# EAGLE schematic humanoid-3 (EAGLE 7.2.0)

## Sheet 1 of 8
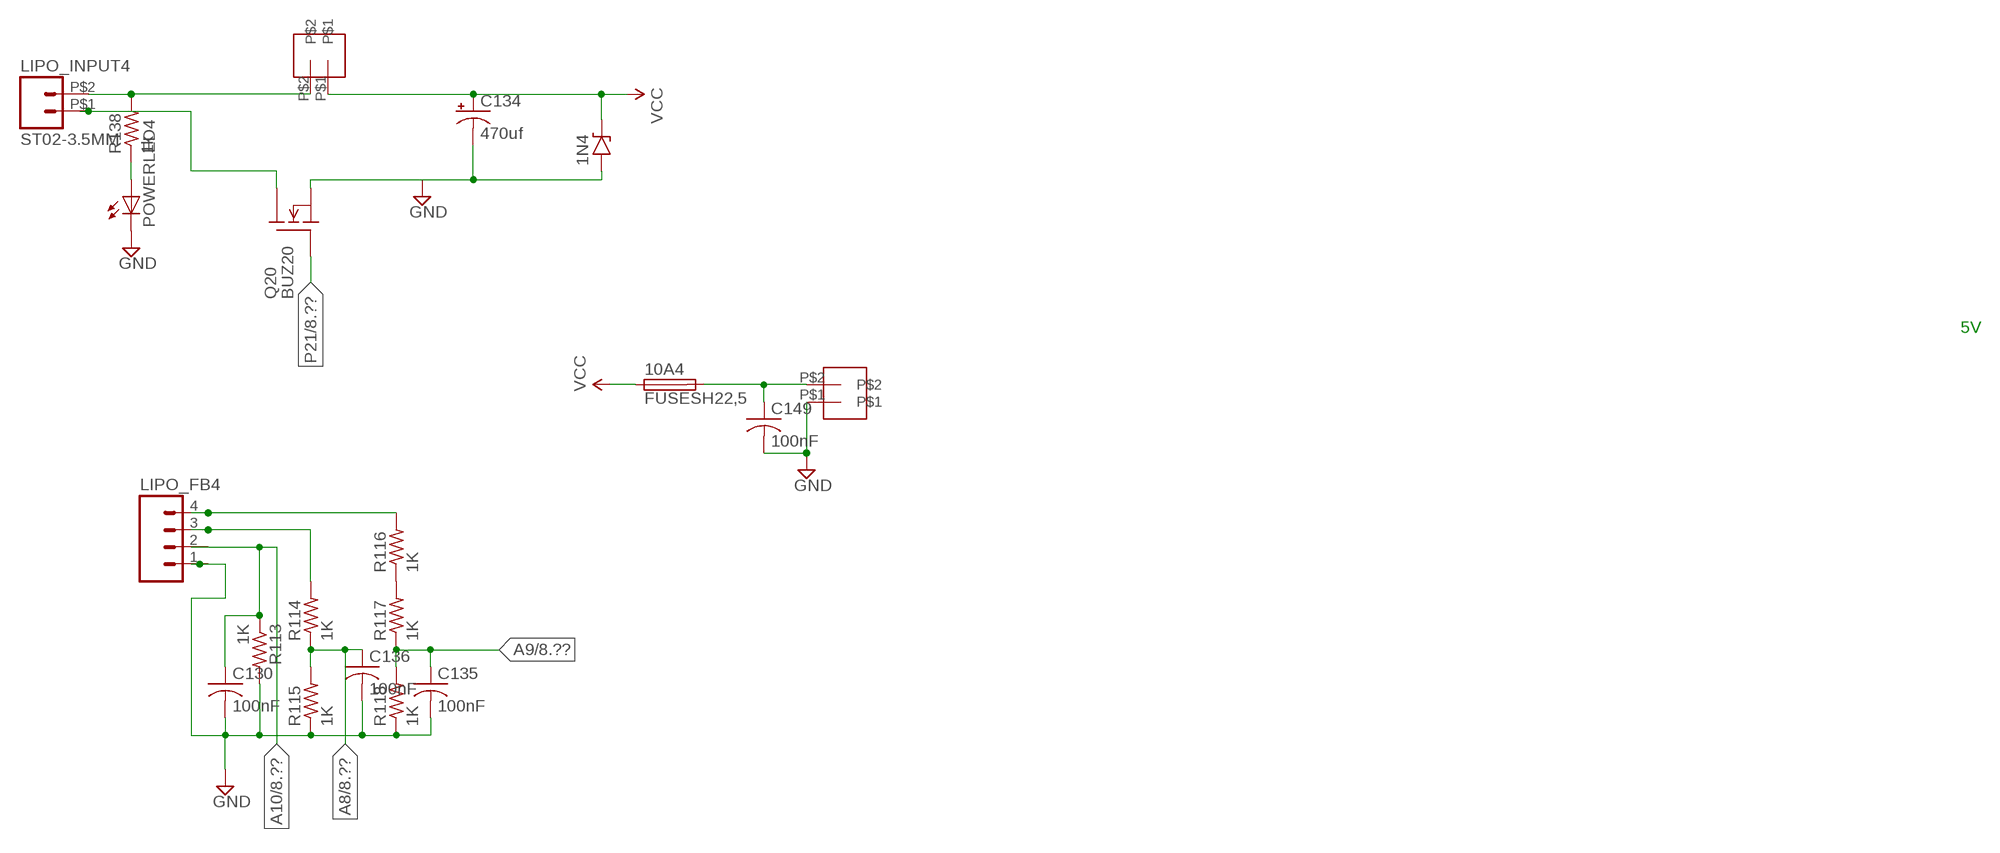
[diagram p0: schematic, sheet 1]

### Parts
1N4  1N47XX3  [DO41-3]
10A4  FUSESH22,5  [SH22,5]
C130  100nF  C-USC1206  [C1206]
C134  470uf  CPOL-USD  [PANASONIC_D]
C135  100nF  C-USC1206  [C1206]
C136  100nF  C-USC1206  [C1206]
C149  100nF  C-USC1206  [C1206]
FITPC4  2PINRIGHT  [2PINRIGHT]
LIPO_FB4  M04PTH  [1X04]
LIPO_INPUT4  ST02-3.5MM  [ED350V-02P]
POWERLED4  LEDCHIPLED_1206  [CHIPLED_1206]
Q20  BUZ20  [TO220]
R113  1K  R-US_M0805  [M0805]
R114  1K  R-US_M0805  [M0805]
R115  1K  R-US_M0805  [M0805]
R116  1K  R-US_M0805  [M0805]
R117  1K  R-US_M0805  [M0805]
R118  1K  R-US_M0805  [M0805]
R138  1k  R-US_M0805  [M0805]
U$89  2PINRIGHT  [2PINRIGHT]

### Nets
A8: C136.1 R114.1 R115.2 ; also sheet 8
A9: C135.1 R117.1 R118.2 ; also sheet 8
A10: C130.1 LIPO_FB4.2 R113.1 ; also sheet 8
GND: 1N4.A C130.2 C134.- C135.2 C136.2 C149.2 FITPC4.P$1 LIPO_FB4.1 POWERLED4.C Q20.3(S) R113.2 R115.1 R118.1 ; also sheet 2,3,4,5,6,7,8
LIPO_FB4: LIPO_FB4.4 R116.2
N$337: R116.1 R117.2
N$338: LIPO_FB4.3 R114.2
N$378: 10A4.2 C149.1 FITPC4.P$2
N$381: POWERLED4.A R138.1
N$383: LIPO_INPUT4.P$1 Q20.2(D)
N$385: LIPO_INPUT4.P$2 R138.2 U$89.P$2
P21: Q20.1(G) ; also sheet 8
VCC: 1N4.C 10A4.1 C134.+ U$89.P$1 ; also sheet 2,3,4

### Notes on the sheet
- 5V

## Sheet 2 of 8
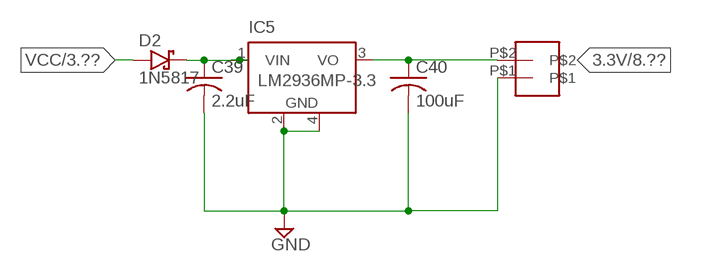
[diagram p1: schematic, sheet 2]

### Parts
3.3V1  2PINRIGHT  [2PINRIGHT]
C39  2.2uF  C-USC1206  [C1206]
C40  100uF  C-USC1206  [C1206]
D2  1N5817  [DO41-3]
IC5  LM2936MP-3.3  [SOT223]

### Nets
3.3V: 3.3V1.P$2 C40.1 IC5.3(VO) ; also sheet 8
GND: 3.3V1.P$1 C39.2 C40.2 IC5.2(GND) IC5.4(GND) ; also sheet 1,3,4,5,6,7,8
N$51: C39.1 D2.C IC5.1(VIN)
VCC: D2.A ; also sheet 1,3,4

## Sheet 3 of 8
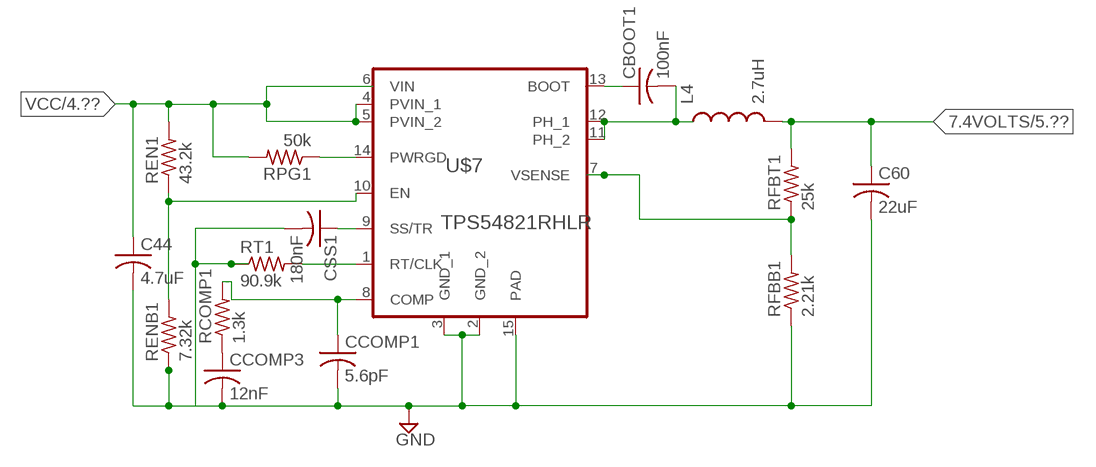
[diagram p2: schematic, sheet 3]

### Parts
C44  4.7uF  C-USC1206  [C1206]
C60  22uF  C-USC1206  [C1206]
CBOOT1  100nF  C-USC1206  [C1206]
CCOMP1  5.6pF  C-USC1206  [C1206]
CCOMP3  12nF  C-USC1206  [C1206]
CSS1  180nF  C-USC1206  [C1206]
L4  2.7uH  INDUCTOR-B82462G  [B82462G]
RCOMP1  1.3k  R-US_M0805  [M0805]
REN1  43.2k  R-US_M0805  [M0805]
RENB1  7.32k  R-US_M0805  [M0805]
RFBB1  2.21k  R-US_M0805  [M0805]
RFBT1  25k  R-US_M0805  [M0805]
RPG1  50k  R-US_M0805  [M0805]
RT1  90.9k  R-US_M0805  [M0805]
U$7  TPS54821RHLR  [S-PVQFN-N14]

### Nets
7.4VOLTS: C60.1 L4.P$2 RFBT1.2 ; also sheet 5
GND: C44.2 C60.2 CCOMP1.2 CCOMP3.2 CSS1.2 RENB1.1 RFBB1.1 RT1.1 U$7.2(GND_2) U$7.3(GND_1) U$7.15(PAD) ; also sheet 1,2,4,5,6,7,8
N$53: CBOOT1.2 L4.P$1 U$7.11(PH_2) U$7.12(PH_1)
N$54: RT1.2 U$7.1(RT/CLK)
N$55: CSS1.1 U$7.9(SS/TR)
N$56: RPG1.1 U$7.14(PWRGD)
N$57: CCOMP3.1 RCOMP1.1
N$58: CCOMP1.1 RCOMP1.2 U$7.8(COMP)
N$59: CBOOT1.1 U$7.13(BOOT)
N$60: RFBB1.2 RFBT1.1 U$7.7(VSENSE)
N$68: REN1.1 RENB1.2 U$7.10(EN)
VCC: C44.1 REN1.2 RPG1.2 U$7.4(PVIN_1) U$7.5(PVIN_2) U$7.6(VIN) ; also sheet 1,2,4

## Sheet 4 of 8
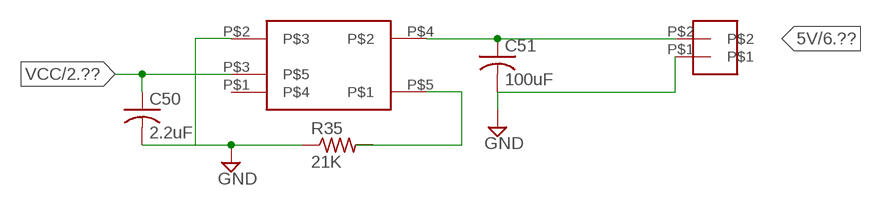
[diagram p3: schematic, sheet 4]

### Parts
5V1  2PINRIGHT  [2PINRIGHT]
C50  2.2uF  C-USC1206  [C1206]
C51  100uF  C-USC1206  [C1206]
R35  21K  R-US_M0805  [M0805]
U$6  PTN7800WTHROUGHHOLE  [PTN7800W]

### Nets
5V: 5V1.P$2 C51.1 U$6.P$4 ; also sheet 6,7,8
GND: 5V1.P$1 C50.2 C51.2 R35.1 U$6.P$2 ; also sheet 1,2,3,5,6,7,8
N$76: R35.2 U$6.P$5
VCC: C50.1 U$6.P$3 ; also sheet 1,2,3
Unconnected: U$6.P$1

## Sheet 5 of 8
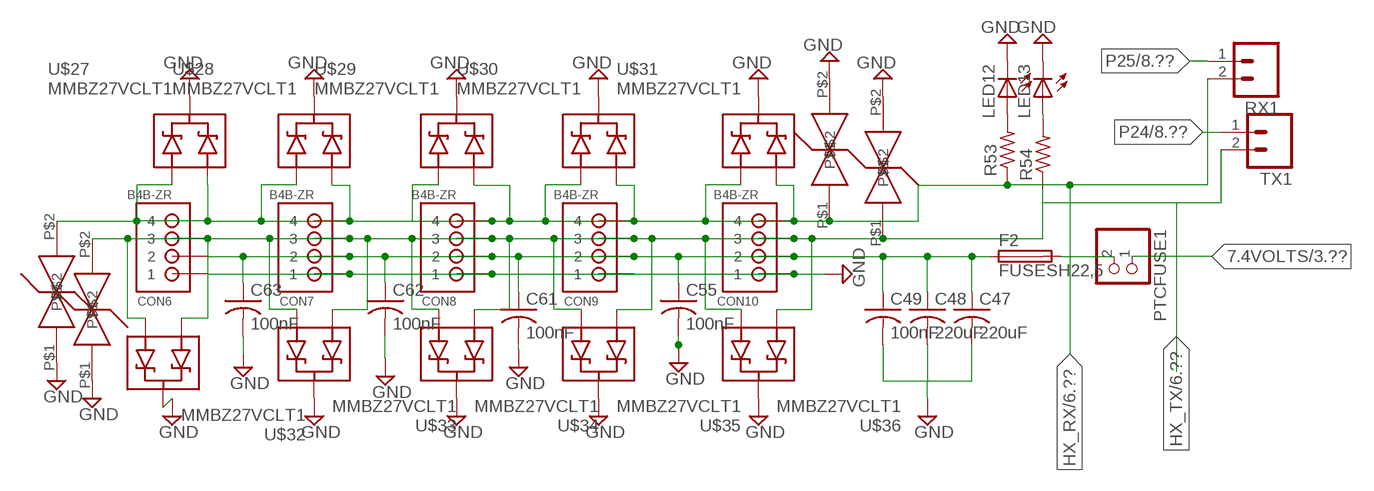
[diagram p4: schematic, sheet 5]

### Parts
C47  220uF  C-USC1206  [C1206]
C48  220uF  C-USC1206  [C1206]
C49  100nF  C-USC1206  [C1206]
C55  100nF  C-USC1206  [C1206]
C61  100nF  C-USC1206  [C1206]
C62  100nF  C-USC1206  [C1206]
C63  100nF  C-USC1206  [C1206]
CON6  B4B-ZR  [B4B-ZR]
CON7  B4B-ZR  [B4B-ZR]
CON8  B4B-ZR  [B4B-ZR]
CON9  B4B-ZR  [B4B-ZR]
CON10  B4B-ZR  [B4B-ZR]
F2  FUSESH22,5  [SH22,5]
LED12  LEDCHIPLED_1206  [CHIPLED_1206]
LED13  LEDCHIPLED_1206  [CHIPLED_1206]
PTCFUSE1  PINHD-1X2  [1X02]
R53  R-US_M0805  [M0805]
R54  R-US_M0805  [M0805]
RX1  M02PTH  [1X02]
TX1  M02PTH  [1X02]
U$11  V18ZA2P  [V18ZA2P]
U$25  V18ZA2P  [V18ZA2P]
U$26  V18ZA2P  [V18ZA2P]
U$27  MMBZ27VCLT1  [SOT23-3]
U$28  MMBZ27VCLT1  [SOT23-3]
U$29  MMBZ27VCLT1  [SOT23-3]
U$30  MMBZ27VCLT1  [SOT23-3]
U$31  MMBZ27VCLT1  [SOT23-3]
U$32  MMBZ27VCLT1  [SOT23-3]
U$33  MMBZ27VCLT1  [SOT23-3]
U$34  MMBZ27VCLT1  [SOT23-3]
U$35  MMBZ27VCLT1  [SOT23-3]
U$36  MMBZ27VCLT1  [SOT23-3]
V18ZA2P1  V18ZA2P  [V18ZA2P]

### Nets
7.4VOLTS: PTCFUSE1.1 ; also sheet 3
GND: C47.2 C48.2 C49.2 C55.2 C61.2 C62.2 CON6.1 CON7.1 CON8.1 CON9.1 CON10.1 LED12.C LED13.C U$11.P$1 U$25.P$2 U$26.P$2 U$27.3(C) U$28.3(C) U$29.3(C) U$30.3(C) U$31.3(C) U$32.3(C) U$33.3(C) U$34.3(C) U$35.3(C) U$36.3(C) V18ZA2P1.P$1 ; also sheet 1,2,3,4,6,7,8
HX_RX: CON6.4 CON7.4 CON8.4 CON9.4 CON10.4 R53.1 RX1.2 U$25.P$1 U$27.1(A1) U$27.2(A2) U$28.1(A1) U$28.2(A2) U$29.1(A1) U$29.2(A2) U$30.1(A1) U$30.2(A2) U$31.1(A1) U$31.2(A2) V18ZA2P1.P$2 ; also sheet 6
HX_TX: CON6.3 CON7.3 CON8.3 CON9.3 CON10.3 R54.1 TX1.2 U$11.P$2 U$26.P$1 U$32.1(A1) U$32.2(A2) U$33.1(A1) U$33.2(A2) U$34.1(A1) U$34.2(A2) U$35.1(A1) U$35.2(A2) U$36.1(A1) U$36.2(A2) ; also sheet 6
N$1: C63.2
N$70: F2.2 PTCFUSE1.2
N$73: LED12.A R53.2
N$74: LED13.A R54.2
N$80: C47.1 C48.1 C49.1 C55.1 C61.1 C62.1 C63.1 CON6.2 CON7.2 CON8.2 CON9.2 CON10.2 F2.1
P24: TX1.1 ; also sheet 8
P25: RX1.1 ; also sheet 8

## Sheet 6 of 8
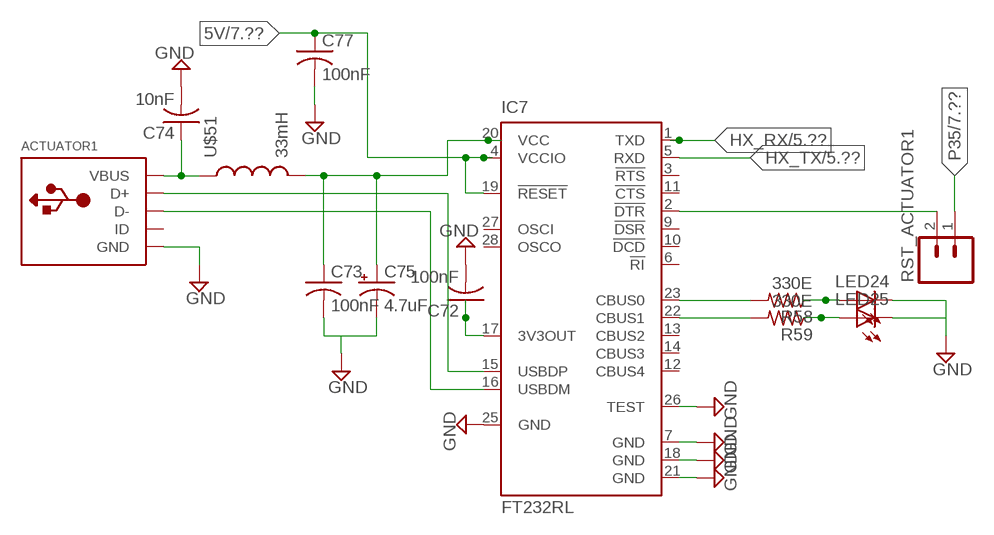
[diagram p5: schematic, sheet 6]

### Parts
ACTUATOR1  USBMINIB  [USB-MINIB]
C72  100nF  C-USC1206  [C1206]
C73  100nF  C-USC1206  [C1206]
C74  10nF  C-USC1206  [C1206]
C75  4.7uF  CPOL-USD  [PANASONIC_D]
C77  100nF  C-USC1206  [C1206]
IC7  FT232RL  [SSOP28]
LED24  LEDCHIPLED_1206  [CHIPLED_1206]
LED25  LEDCHIPLED_1206  [CHIPLED_1206]
R58  330E  R-US_M0805  [M0805]
R59  330E  R-US_M0805  [M0805]
RST_ACTUATOR1  M02PTH  [1X02]
U$51  33mH  INDUCTOR-B82462G  [B82462G]

### Nets
5V: C77.1 IC7.4(VCCIO) IC7.19(!RESET) ; also sheet 4,7,8
GND: ACTUATOR1.GND C72.2 C73.2 C74.2 C75.- C77.2 IC7.7(GND) IC7.18(GND) IC7.21(GND) IC7.25(GND) IC7.26(TEST) LED24.C LED25.C ; also sheet 1,2,3,4,5,7,8
HX_RX: IC7.1(TXD) ; also sheet 5
HX_TX: IC7.5(RXD) ; also sheet 5
N$92: ACTUATOR1.VBUS C74.1 U$51.P$1
N$93: C73.1 C75.+ IC7.20(VCC) U$51.P$2
N$94: ACTUATOR1.D+ IC7.15(USBDP)
N$95: ACTUATOR1.D- IC7.16(USBDM)
N$106: IC7.23(CBUS0) R58.2
N$108: IC7.22(CBUS1) R59.2
N$109: LED24.A R58.1
N$114: LED25.A R59.1
N$115: C72.1 IC7.17(3V3OUT)
N$116: IC7.2(!DTR) RST_ACTUATOR1.2
P35: RST_ACTUATOR1.1 ; also sheet 7,8
Unconnected: ACTUATOR1.ID IC7.3(!RTS) IC7.6(!RI) IC7.9(!DSR) IC7.10(!DCD) IC7.11(!CTS) IC7.12(CBUS4) IC7.13(CBUS2) IC7.14(CBUS3) IC7.27(OSCI) IC7.28(OSCO)

## Sheet 7 of 8
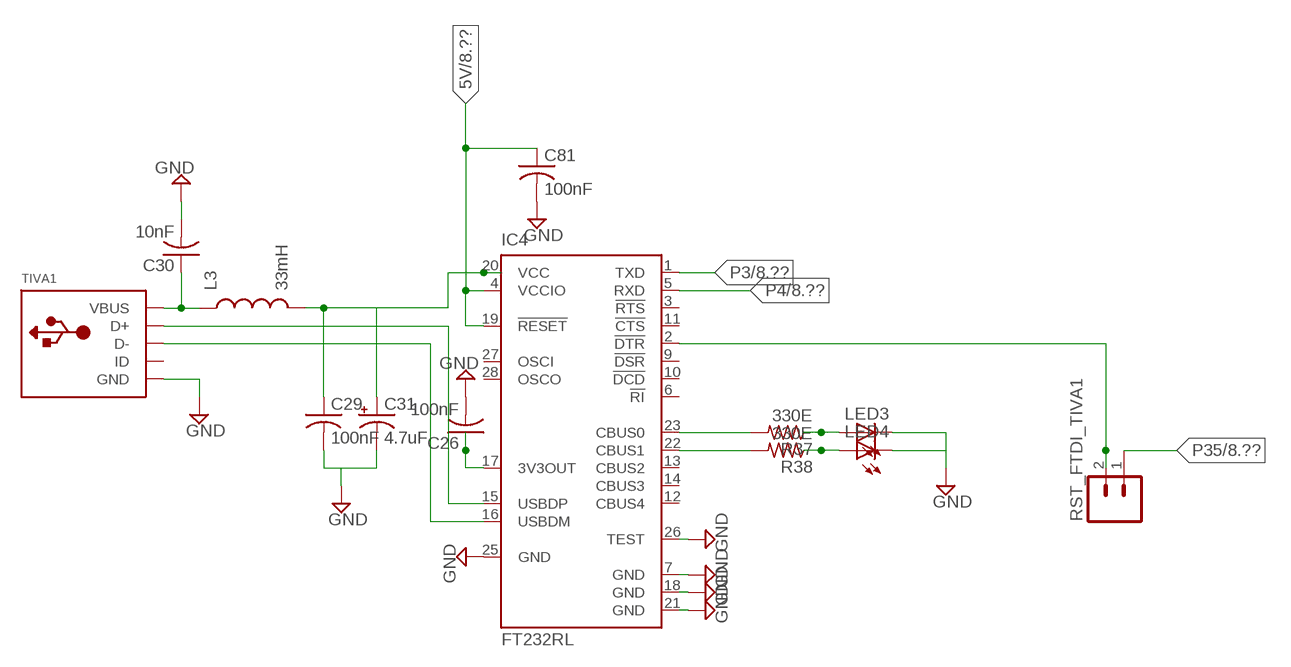
[diagram p6: schematic, sheet 7]

### Parts
C26  100nF  C-USC1206  [C1206]
C29  100nF  C-USC1206  [C1206]
C30  10nF  C-USC1206  [C1206]
C31  4.7uF  CPOL-USD  [PANASONIC_D]
C81  100nF  C-USC1206  [C1206]
IC4  FT232RL  [SSOP28]
L3  33mH  INDUCTOR-B82462G  [B82462G]
LED3  LEDCHIPLED_1206  [CHIPLED_1206]
LED4  LEDCHIPLED_1206  [CHIPLED_1206]
R37  330E  R-US_M0805  [M0805]
R38  330E  R-US_M0805  [M0805]
RST_FTDI_TIVA1  M02PTH  [1X02]
TIVA1  USBMINIB  [USB-MINIB]

### Nets
5V: C81.1 IC4.4(VCCIO) IC4.19(!RESET) ; also sheet 4,6,8
GND: C26.2 C29.2 C30.2 C31.- C81.2 IC4.7(GND) IC4.18(GND) IC4.21(GND) IC4.25(GND) IC4.26(TEST) LED3.C LED4.C TIVA1.GND ; also sheet 1,2,3,4,5,6,8
N$7: C30.1 L3.P$1 TIVA1.VBUS
N$10: C29.1 C31.+ IC4.20(VCC) L3.P$2
N$11: IC4.15(USBDP) TIVA1.D+
N$12: IC4.16(USBDM) TIVA1.D-
N$13: IC4.23(CBUS0) R37.2
N$19: IC4.22(CBUS1) R38.2
N$22: LED3.A R37.1
N$33: LED4.A R38.1
N$34: C26.1 IC4.17(3V3OUT)
N$35: IC4.2(!DTR) RST_FTDI_TIVA1.2
P3: IC4.1(TXD) ; also sheet 8
P4: IC4.5(RXD) ; also sheet 8
P35: RST_FTDI_TIVA1.1 ; also sheet 6,8
Unconnected: IC4.3(!RTS) IC4.6(!RI) IC4.9(!DSR) IC4.10(!DCD) IC4.11(!CTS) IC4.12(CBUS4) IC4.13(CBUS2) IC4.14(CBUS3) IC4.27(OSCI) IC4.28(OSCO) TIVA1.ID

## Sheet 8 of 8
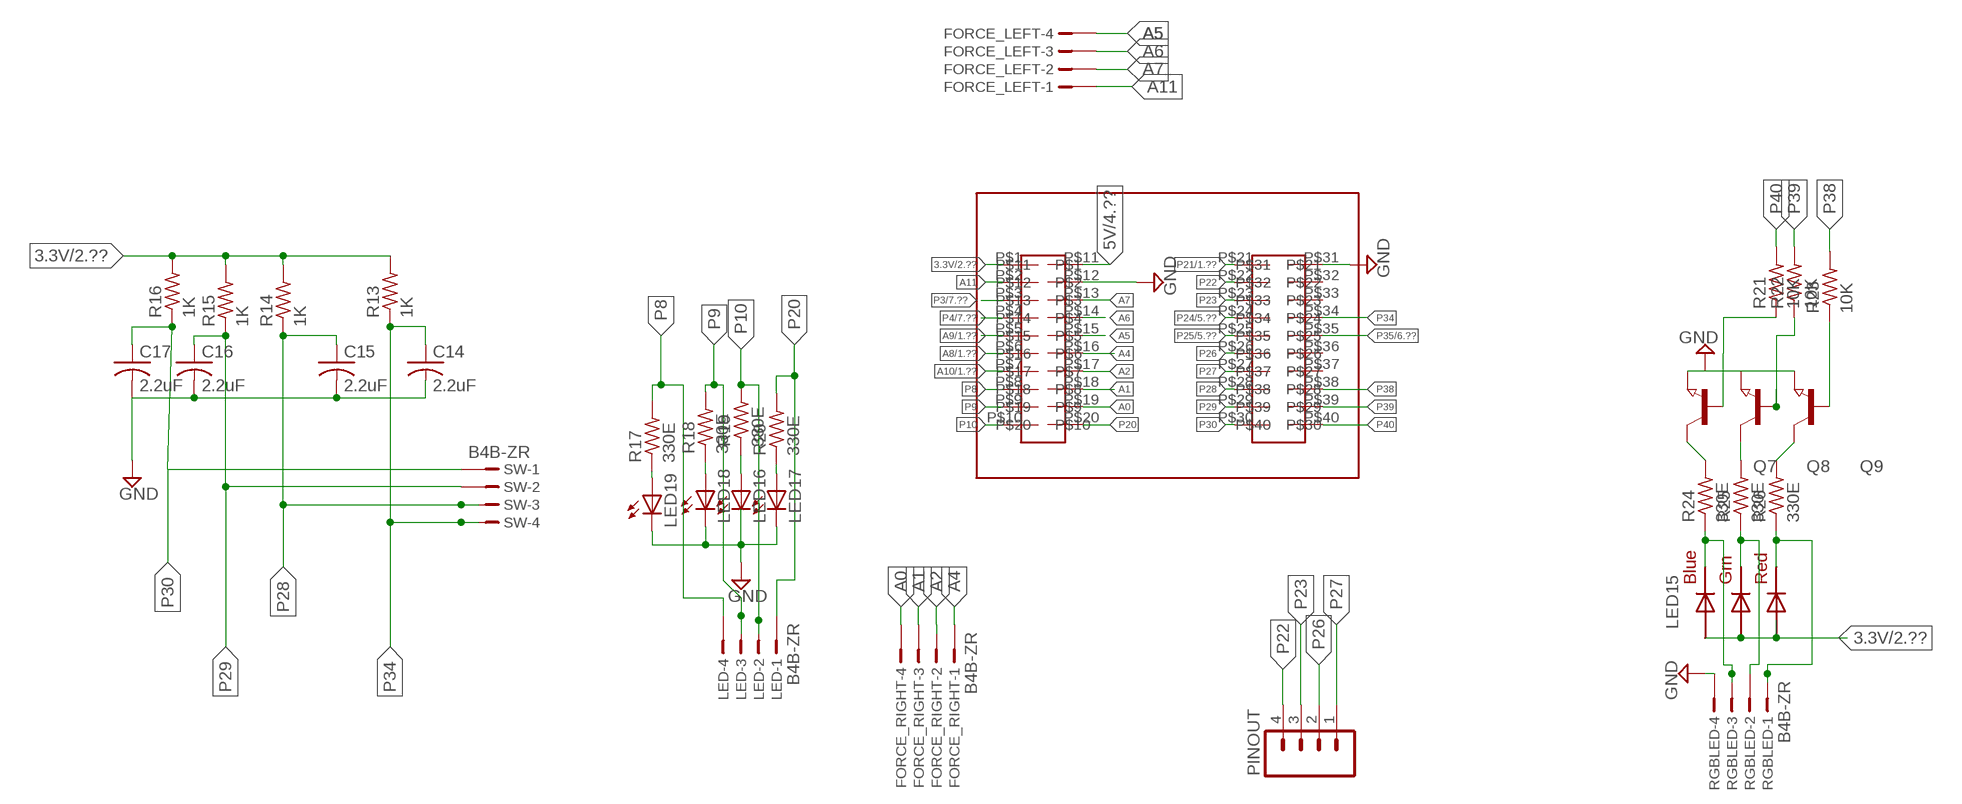
[diagram p7: schematic, sheet 8]

### Parts
C14  2.2uF  C-USC1206  [C1206]
C15  2.2uF  C-USC1206  [C1206]
C16  2.2uF  C-USC1206  [C1206]
C17  2.2uF  C-USC1206  [C1206]
FORCE_LEFT  B4B-ZR  [B4B-ZR]
FORCE_RIGHT  B4B-ZR  [B4B-ZR]
LED  B4B-ZR  [B4B-ZR]
LED15  RGBLED5050  [RGBLED5050]
LED16  LEDCHIPLED_1206  [CHIPLED_1206]
LED17  LEDCHIPLED_1206  [CHIPLED_1206]
LED18  LEDCHIPLED_1206  [CHIPLED_1206]
LED19  LEDCHIPLED_1206  [CHIPLED_1206]
PINOUT  M04PTH  [1X04]
Q7  NPN-TRANSISTOR_SOT23  [SOT23]
Q8  NPN-TRANSISTOR_SOT23  [SOT23]
Q9  NPN-TRANSISTOR_SOT23  [SOT23]
R13  1K  R-US_M0805  [M0805]
R14  1K  R-US_M0805  [M0805]
R15  1K  R-US_M0805  [M0805]
R16  1K  R-US_M0805  [M0805]
R17  330E  R-US_M0805  [M0805]
R18  330E  R-US_M0805  [M0805]
R19  330E  R-US_M0805  [M0805]
R20  330E  R-US_M0805  [M0805]
R21  10K  R-US_M0805  [M0805]
R22  10K  R-US_M0805  [M0805]
R23  10K  R-US_M0805  [M0805]
R24  330E  R-US_M0805  [M0805]
R25  330E  R-US_M0805  [M0805]
R26  330E  R-US_M0805  [M0805]
RGBLED  B4B-ZR  [B4B-ZR]
SW  B4B-ZR  [B4B-ZR]
U$1  TIVA  [TIVA]

### Nets
3.3V: LED15.1(GREEN_A) LED15.2(RED_A) LED15.3(BLUE_A) R13.2 R14.2 R15.2 R16.2 U$1.P$1 ; also sheet 2
5V: U$1.P$11 ; also sheet 4,6,7
A0: FORCE_RIGHT.4 U$1.P$19
A1: FORCE_RIGHT.3 U$1.P$18
A2: FORCE_RIGHT.2 U$1.P$17
A4: FORCE_RIGHT.1 U$1.P$16
A5: FORCE_LEFT.4 U$1.P$15
A6: FORCE_LEFT.3 U$1.P$14
A7: FORCE_LEFT.2 U$1.P$13
A8: U$1.P$6 ; also sheet 1
A9: U$1.P$5 ; also sheet 1
A10: U$1.P$7 ; also sheet 1
A11: FORCE_LEFT.1 U$1.P$2
GND: C14.2 C15.2 C16.2 C17.2 LED16.C LED17.C LED18.C LED19.C Q7.2(E) Q8.2(E) Q9.2(E) RGBLED.4 U$1.P$12 U$1.P$31 ; also sheet 1,2,3,4,5,6,7
N$9: Q9.3(C) R26.2
N$107: Q8.3(C) R25.2
N$110: Q7.3(C) R24.2
N$111: LED15.4(BLUE_C) R24.1 RGBLED.3
N$112: LED15.6(GREEN_C) R25.1 RGBLED.2
N$113: LED15.5(RED_C) R26.1 RGBLED.1
N$117: Q9.1(B) R23.1
N$118: R21.1
N$119: Q7.1(B)
N$121: Q8.1(B) R22.1
N$122: LED18.A R18.1
N$123: LED16.A R19.1
N$125: LED19.A R17.1
N$126: LED17.A R20.1
P3: U$1.P$3 ; also sheet 7
P4: U$1.P$4 ; also sheet 7
P8: LED.4 R17.2 U$1.P$8
P9: LED.3 R18.2 U$1.P$9
P10: LED.2 R19.2 U$1.P$10
P20: LED.1 R20.2 U$1.P$20
P21: U$1.P$21 ; also sheet 1
P22: PINOUT.4 U$1.P$22
P23: PINOUT.3 U$1.P$23
P24: U$1.P$24 ; also sheet 5
P25: U$1.P$25 ; also sheet 5
P26: PINOUT.2 U$1.P$26
P27: PINOUT.1 U$1.P$27
P28: C15.1 R14.1 SW.3 U$1.P$28
P29: C16.1 R15.1 SW.2 U$1.P$29
P30: C17.1 R16.1 SW.1 U$1.P$30
P34: C14.1 R13.1 SW.4 U$1.P$34
P35: U$1.P$35 ; also sheet 6,7
P38: R23.2 U$1.P$38
P39: R22.2 U$1.P$39
P40: R21.2 U$1.P$40
Unconnected: U$1.P$32 U$1.P$33 U$1.P$36 U$1.P$37

## Library data of the parts
1N4 = gm-diodes:1N47XX: Zener Diode 1N4728 - 1N4764: 3.3 V - 100V, 10% (1n47xxA 5%); DO-41 glass case
3.3V1 5V1 FITPC4 U$89 = jst 2.5mm:2PINRIGHT
10A4 F2 = fuse:FUSE: Fuse; OC_FARNELL: unknown; OC_NEWARK: unknown
ACTUATOR1 TIVA1 = adafruit:USB: USB Connectors USBMINIB - Surface Mount Female Mini-B USB Connector 4UConnector: 06564 By microbuilder.eu Thru-hole RA Female Mini-B USB Connector 4UConnector: 18732 By ladyada.net
C14-C17 C26 C29 C30 C39 C40 C44 C47-C51 C55 C60-C63 C72-C74 C77 C81 C130 C135 C136 C149 CBOOT1 CCOMP1 CCOMP3 CSS1 = adafruit:C-US: CAPACITOR, American symbol
C31 C75 C134 = adafruit:CPOL-US: POLARIZED CAPACITOR, American symbol
CON6-CON10 = jst_herkulex:B4B-ZR: JST-ZH Connector 4 pol, 1.5mm pitch Package: B4B-ZR Source: http://www.jst-mfg.com/product/pdf/eng/eZH.pdf
D2 = gm-diodes:1N5817
FORCE_LEFT FORCE_RIGHT LED RGBLED SW = con-jst:?4B-ZR: ZH CONNECTOR 1.5 mm, 4 pin 1 row Source: http://www.jst.com .. eZH.pdf; MF: FARNELL; MPN: B4B-ZR(LF)(SN); OC_FARNELL: 1830916; OC_NEWARK: 37K9960
IC4 IC7 = ftdichip:FT232R: Source: http://www.ftdichip.com/Documents/DataSheets/DS_FT232R_v104.pdf; MPN: FT232RL; OC_FARNELL: 1146032; OC_NEWARK: 91K9918
IC5 = national-semiconductor:LM2936MP?*: Ultra-Low Quiescent Current LDO Voltage Regulator Source: Data sheet <http://www.national.com/ds/LM/LM2936.pdf>; MF: NATIONAL SEMICONDUCTOR; MPN: LM2936MP-3.3/NOPB; OC_FARNELL: 1469062; OC_NEWARK: 41K4523
L3 L4 U$51 = SparkFun:INDUCTOR: Inductors Basic Inductor/Choke - 0603 and 1206. Footprints are not proven and vary greatly between part numbers.
LED3 LED4 LED12 LED13 LED16-LED19 LED24 LED25 POWERLED4 = adafruit:LED: LED OSRAM: - CHIPLED LG R971, LG N971, LY N971, LG Q971, LY Q971, LO R971, LY R971 LH N974, LH R974 LS Q976, LO Q976, LY Q976 LO Q996 - Hyper CHIPLED LW Q18S LB Q993, LB Q99A, LB R99A - SideLED LS A670, LO A670, LY A670, LG A670, LP A670 LB A673, LV A673, LT A673, LW A673 LH A674 LY A675 LS A676, LA A676, LO A676, LY A676, LW A676 LS A679, LY A679, LG A679 - Hyper Micro SIDELED® LS Y876, LA Y876, LO Y876, LY Y876 LT Y87S - SmartLED LW L88C, LW L88S LB L89C, LB L89S, LG L890 LS L89K, LO L89K, LY L89K LS L896, LA L896, LO L896, LY L896 - TOPLED LS T670, LO T670, LY T670, LG T670, LP T670 LSG T670, LSP T670, LSY T670, LOP T670, LYG T670 LG T671, LOG T671, LSG T671 LB T673, LV T673, LT T673, LW T673 LH T674 LS T676, LA T676, LO T676, LY T676, LB T676, LH T676, LSB T676, LW T676 LB T67C, LV T67C, LT T67C, LS T67K, LO T67K, LY T67K, LW E67C LS E67B, LA E67B, LO E67B, LY E67B, LB E67C, LV E67C, LT E67C LW T67C LS T679, LY T679, LG T679 LS T770, LO T770, LY T770, LG T770, LP T770 LB T773, LV T773, LT T773, LW T773 LH T774 LS E675, LA E675, LY E675, LS T675 LS T776, LA T776, LO T776, LY T776, LB T776 LHGB T686 LT T68C, LB T68C - Hyper Mini TOPLED® LB M676 - Mini TOPLED Santana® LG M470 LS M47K, LO M47K, LY M47K Source: http://www.osram.convergy.de/
LED15 = adafruit:RGBLED: For 5050 RGB LEDs, the order of the LEDs may vary from one manufacturer to another!
LIPO_FB4 PINOUT = SparkFun:M04: Header 4 Standard 4-pin 0.1" header. Use with straight break away headers (SKU : PRT-00116), right angle break away headers (PRT-00553), swiss pins (PRT-00743), machine pins (PRT-00117), and female headers (PRT-00115). Molex polarized connector foot print use with SKU : PRT-08231 with associated crimp pins and housings.
LIPO_INPUT4 = con-dinkle:ST02: Dinkle® Screw Terminal Block - 2 Way -5MM: EK500V series. Rated at 20A, 300VAC. Cable size: 2mm² Supplier: Altronics P2034A Source: http://www.dinkle.com/upfiles/proter21253708953.pdf -5.08MM: The back half of a EK500V4R-04P. Rated at 20A, 300VAC. Cable size: 2mm² Supplier: Altronics P2024 (half of) Source: http://www.dinkle.com/upfiles/proter21253708833.pdf -3.5MM: ED350V series. Rated at 10A, 300VAC. Cable size: 1.4mm² Supplier: Altronics P2028 Source: http://www.dinkle.com/upfiles/proter21253714491.pdf
PTCFUSE1 = pinhead:PINHD-1X2: PIN HEADER
Q7-Q9 = semicon-smd-ipc:NPN-TRANSISTOR_: NPN TRANSISTOR
Q20 = transistor-fet:BUZ20: N-Channel Enhancement MOSFET 100V; 12A; 0,2Ohm
R13-R26 R35 R37 R38 R53 R54 R58 R59 R113-R118 R138 RCOMP1 REN1 RENB1 RFBB1 RFBT1 RPG1 RT1 = resistor:R-US_: RESISTOR, American symbol
RST_ACTUATOR1 RST_FTDI_TIVA1 RX1 TX1 = SparkFun:M02: Header 2 Standard 2-pin 0.1" header. Use with straight break away headers (SKU : PRT-00116), right angle break away headers (PRT-00553), swiss pins (PRT-00743), machine pins (PRT-00117), and female headers (PRT-00115). Molex polarized connector foot print use with SKU : PRT-08233 with associated crimp pins and housings.
U$1 = tiva:TIVA
U$6 = PTN7800W:PTN7800W
U$7 = alim:TPS54821RHLR; DATASHEETURL: http://www.ti.com/product/tps54821; FREQUENCY: 1600000.0; IMAX: 8.0; MANUFACTURER_NAME: Texas Instruments; MANUFACTURER_PART_NUMBER: TPS54821RHLR; MKTG_PACKAGE: S-PVQFN-N14; NSID: TPS54821RHLR; PACKAGE: S-PVQFN-N14; VENDOR: Texas Instruments
U$11 U$25 U$26 V18ZA2P1 = SparkFun-DiscreteSemi:V18ZA2P: Varistor
U$27-U$36 = SparkFun-DiscreteSemi:MMBZ27VCLT1: 40W Zener-diode transient voltage suppressor (ESD protection)

## Net classes
0 default: width 0.35 mm